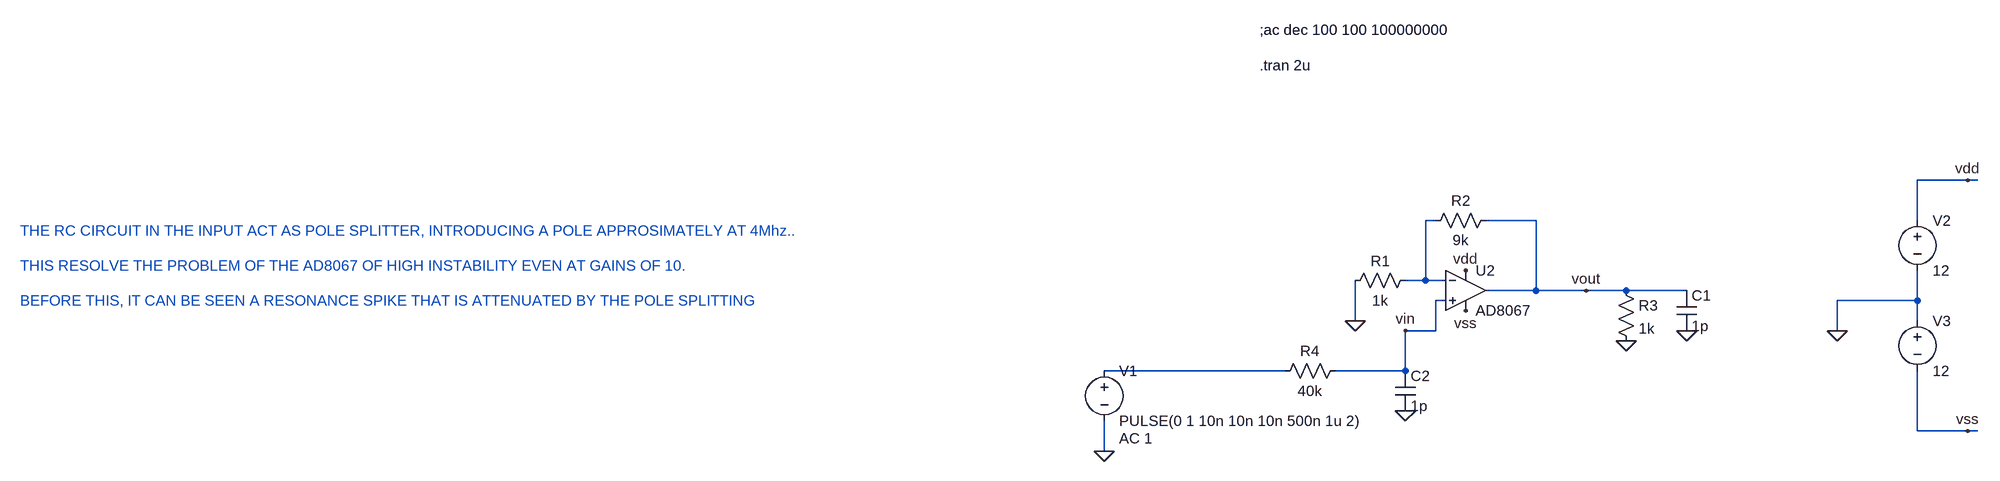
[diagram p0: schematic AD8033&AD8067_confronto_stabilita'_slewRate.asc]
AD8033&AD8067_confronto_stabilita'_slewRate.asc, the LTspice schematic file:
Version 4
SHEET 1 1112 1044
WIRE 1072 0 992 0
WIRE 1088 0 1072 0
WIRE 224 64 208 64
WIRE 384 64 304 64
WIRE 992 64 992 0
WIRE 208 160 208 64
WIRE 208 160 176 160
WIRE 240 160 208 160
WIRE 384 176 384 64
WIRE 384 176 304 176
WIRE 464 176 384 176
WIRE 528 176 464 176
WIRE 624 176 528 176
WIRE 240 192 224 192
WIRE 992 192 992 144
WIRE 992 192 864 192
WIRE 96 224 96 160
WIRE 992 224 992 192
WIRE 224 240 224 192
WIRE 224 240 176 240
WIRE 864 240 864 192
WIRE -16 304 -304 304
WIRE 176 304 176 240
WIRE 176 304 64 304
WIRE 992 400 992 304
WIRE 1072 400 992 400
WIRE 1088 400 1072 400
WIRE -304 432 -304 384
FLAG 96 224 0
FLAG -304 432 0
FLAG 272 144 vdd
FLAG 272 208 vss
FLAG 1072 0 vdd
FLAG 1072 400 vss
FLAG 864 240 0
FLAG 464 176 vout
FLAG 176 240 vin
FLAG 528 256 0
FLAG 624 240 0
FLAG 176 368 0
SYMBOL res 192 144 R90
WINDOW 0 0 56 VBottom 2
WINDOW 3 32 56 VTop 2
SYMATTR InstName R1
SYMATTR Value 1k
SYMBOL res 320 48 R90
WINDOW 0 0 56 VBottom 2
WINDOW 3 32 56 VTop 2
SYMATTR InstName R2
SYMATTR Value 9k
SYMBOL voltage -304 288 R0
WINDOW 123 24 124 Left 2
WINDOW 39 0 0 Left 0
SYMATTR Value2 AC 1
SYMATTR InstName V1
SYMATTR Value PULSE(0 1 10n 10n 10n 500n 1u 2)
SYMBOL voltage 992 48 R0
WINDOW 123 0 0 Left 0
WINDOW 39 0 0 Left 0
SYMATTR InstName V2
SYMATTR Value 12
SYMBOL voltage 992 208 R0
WINDOW 123 0 0 Left 0
WINDOW 39 0 0 Left 0
SYMATTR InstName V3
SYMATTR Value 12
SYMBOL res 512 160 R0
SYMATTR InstName R3
SYMATTR Value 1k
SYMBOL cap 608 176 R0
SYMATTR InstName C1
SYMATTR Value 1p
SYMBOL OpAmps\\AD8067 272 112 R0
SYMATTR InstName U2
SYMBOL res 80 288 R90
WINDOW 0 0 56 VBottom 2
WINDOW 3 32 56 VTop 2
SYMATTR InstName R4
SYMATTR Value 40k
SYMBOL cap 160 304 R0
SYMATTR InstName C2
SYMATTR Value 1p
TEXT -2032 80 Left 2 ;THE RC CIRCUIT IN THE INPUT ACT AS POLE SPLITTER, INTRODUCING A POLE APPROSIMATELY AT 4Mhz..
TEXT -2032 136 Left 2 ;THIS RESOLVE THE PROBLEM OF THE AD8067 OF HIGH INSTABILITY EVEN AT GAINS OF 10.
TEXT -2032 192 Left 2 ;BEFORE THIS, IT CAN BE SEEN A RESONANCE SPIKE THAT IS ATTENUATED BY THE POLE SPLITTING
TEXT -56 -184 Left 2 !.tran 2u
TEXT -56 -240 Left 2 !;ac dec 100 100 100000000

The netlist it stands for:
* AD8033&AD8067_confronto_stabilita'_slewRate.asc
R1 N001 0 1k
R2 vout N001 9k
V1 N002 0 PULSE(0 1 10n 10n 10n 500n 1u 2) AC 1
V2 vdd 0 12
V3 0 vss 12
R3 vout 0 1k
C1 vout 0 1p
XU2 vin N001 vdd vss vout AD8067  ; pins In+ In- V+ V- OUT
R4 vin N002 40k
C2 vin 0 1p
* THE RC CIRCUIT IN THE INPUT ACT AS POLE SPLITTER, INTRODUCING A POLE APPROSIMATELY AT 4Mhz..
* THIS RESOLVE THE PROBLEM OF THE AD8067 OF HIGH INSTABILITY EVEN AT GAINS OF 10.
* BEFORE THIS, IT CAN BE SEEN A RESONANCE SPIKE THAT IS ATTENUATED BY THE POLE SPLITTING
.tran 2u
;ac dec 100 100 100000000
.backanno
.end